# EAGLE design untitled (EAGLE 9.5.1)
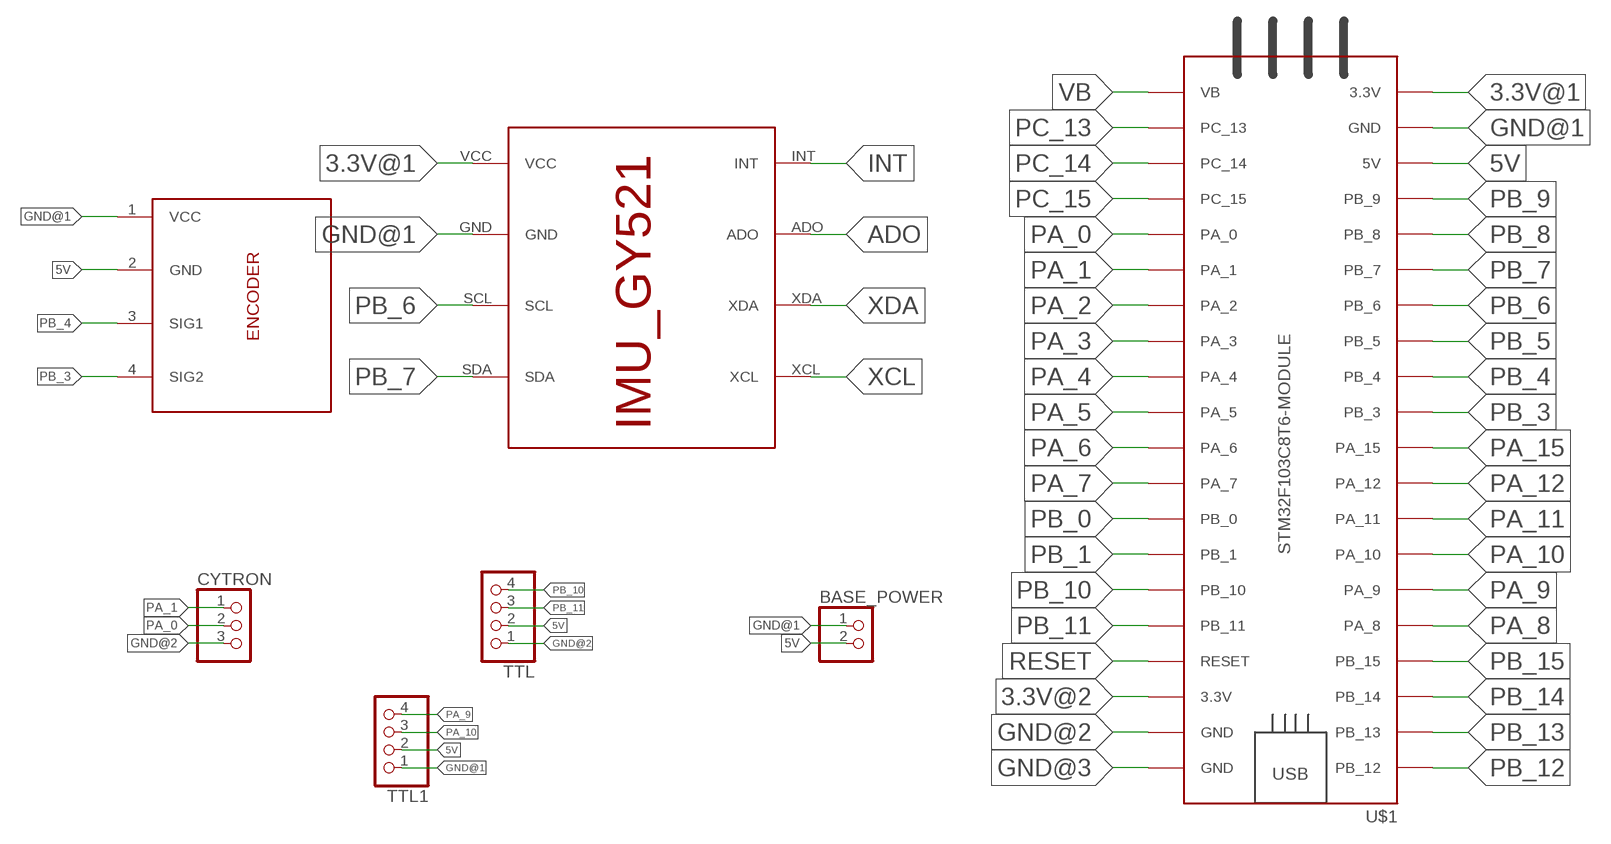
[diagram p0: schematic, sheet 1]

## Parts
BASE_POWER  PINHD-2_DATA  [1X02_DATA]
CYTRON  PINHD-3_DATA  [1X03_DATA]
TTL  PINHD-4_DATA  [1X04_DATA]
TTL1  PINHD-4_DATA  [1X04_DATA]
U$1  STM32F103C8T6-MODULE  [STM32F103C8T6-MODULE]
U$2  IMU_ROBOCON_GY521  [IMU_GY521]
U$3  ENCODER  [1X04_DATA]

## Nets
3.3V@1: U$1.3.3V_1(3.3V) U$2.VCC
3.3V@2: U$1.3.3V_2(3.3V)
5V: BASE_POWER.2 TTL1.2 TTL.2 U$1.5V U$3.2(GND)
ADO: U$2.ADO
GND@1: BASE_POWER.1 TTL1.1 U$1.GND_1(GND) U$2.GND U$3.1(VCC)
GND@2: CYTRON.3 TTL.1 U$1.GND_2(GND)
GND@3: U$1.GND_3(GND)
INT: U$2.INT
PA_0: CYTRON.2 U$1.PA_0
PA_1: CYTRON.1 U$1.PA_1
PA_2: U$1.PA_2
PA_3: U$1.PA_3
PA_4: U$1.PA_4
PA_5: U$1.PA_5
PA_6: U$1.PA_6
PA_7: U$1.PA_7
PA_8: U$1.PA_8
PA_9: TTL1.4 U$1.PA_9
PA_10: TTL1.3 U$1.PA_10
PA_11: U$1.PA_11
PA_12: U$1.PA_12
PA_15: U$1.PA_15
PB_0: U$1.PB_0
PB_1: U$1.PB_1
PB_3: U$1.PB_3 U$3.4(SIG2)
PB_4: U$1.PB_4 U$3.3(SIG1)
PB_5: U$1.PB_5
PB_6: U$1.PB_6 U$2.SCL
PB_7: U$1.PB_7 U$2.SDA
PB_8: U$1.PB_8
PB_9: U$1.PB_9
PB_10: TTL.4 U$1.PB_10
PB_11: TTL.3 U$1.PB_11
PB_12: U$1.PB_12
PB_13: U$1.PB_13
PB_14: U$1.PB_14
PB_15: U$1.PB_15
PC_13: U$1.PC_13
PC_14: U$1.PC_14
PC_15: U$1.PC_15
RESET: U$1.RESET
VB: U$1.VB
XCL: U$2.XCL
XDA: U$2.XDA

## Library data of the parts
BASE_POWER = MIA_LIBRARY-2-2-2:PINHD-2_DATA: PIN HEADER
CYTRON = MIA_LIBRARY-2-2-2:PINHD-3_DATA: PIN HEADER
TTL TTL1 = MIA_LIBRARY-2-2-2:PINHD-4_DATA: PIN HEADER
U$1 = MIA_LIBRARY-2-2-2:STM32F103C8T6-MODULE: STM32F103C8T6 module with ARM Cortex-3, 20kB SRAM, 64kB Flash, 72MHz
U$2 = MIA_LIBRARY-2-2-2:IMU_ROBOCON_GY521
U$3 = MIA_LIBRARY-2-2-2:ENCODER

## Board
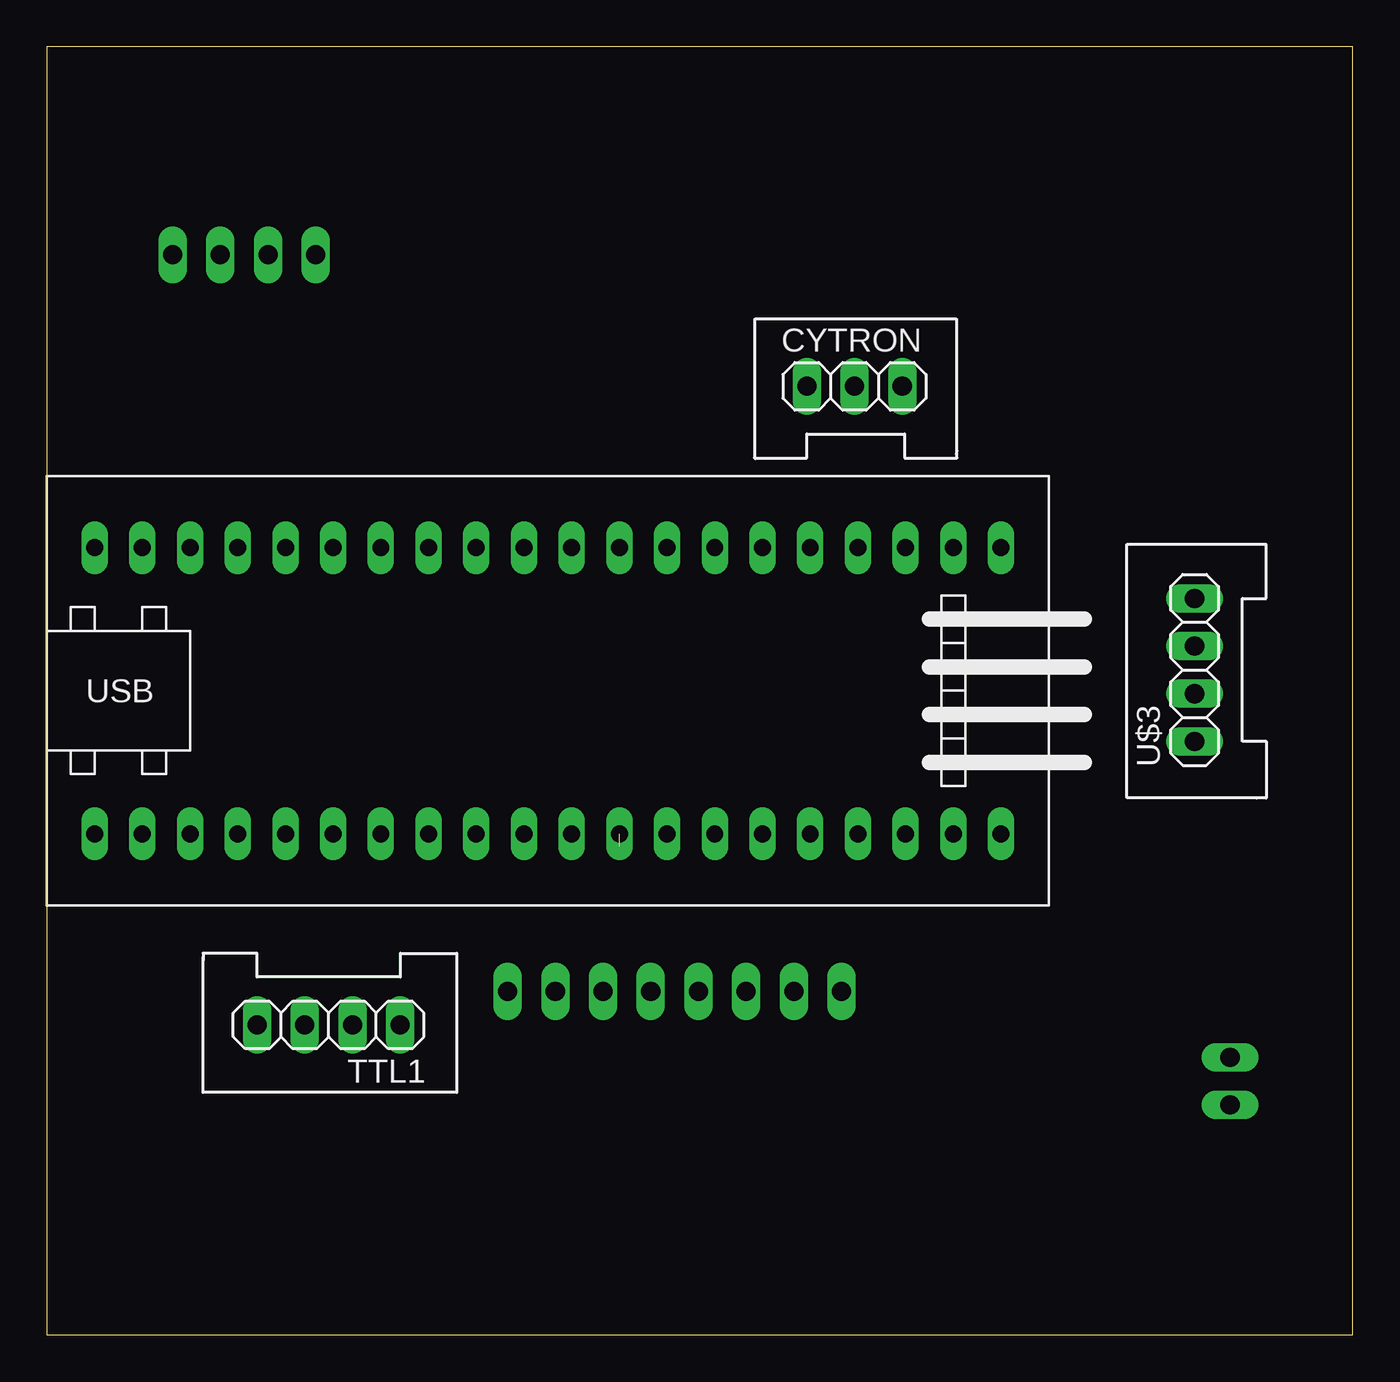
[diagram p1: board, top side]
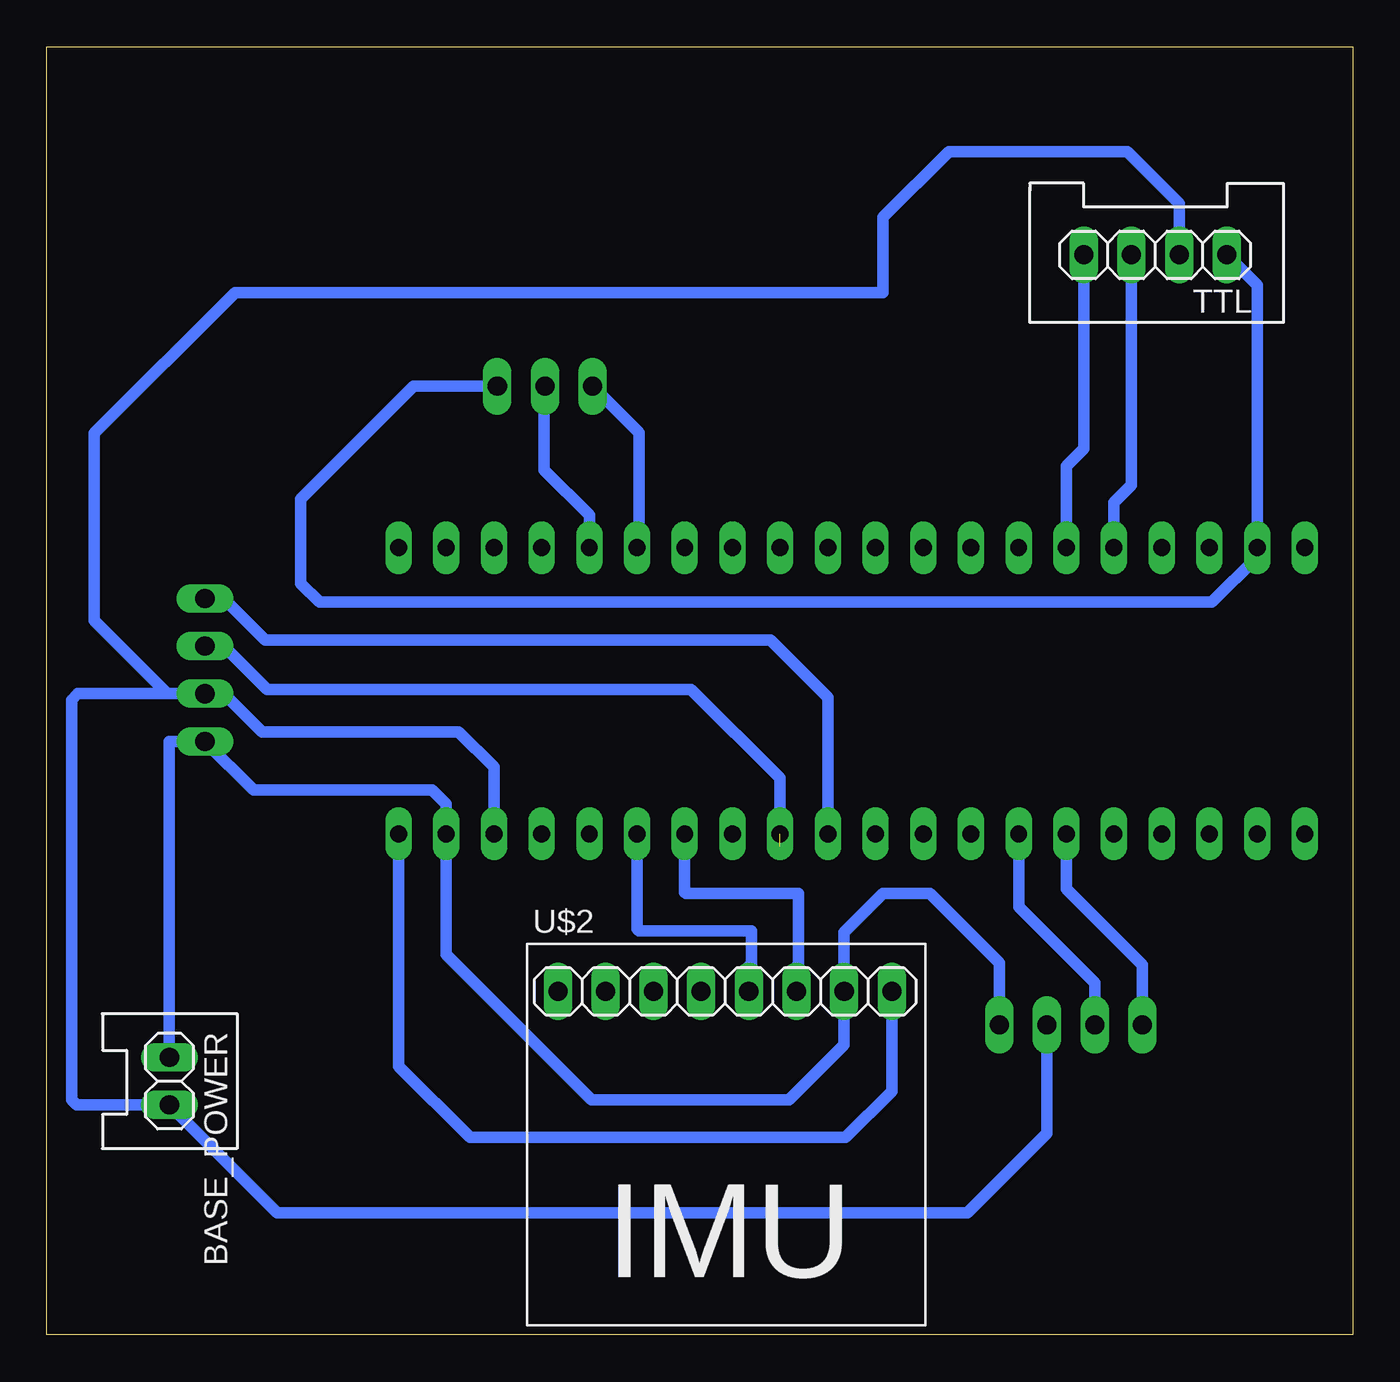
[diagram p2: board, bottom side, seen from below]

Size 69.52 x 68.57 mm. Coordinates in mm from the lower left corner, seen from the top.
Outline: 0,0 69.52,0 69.52,68.57 0,68.57 0,0
Copper layers (1*16): Top 0.035mm / dielectric 1.5mm / Bottom 0.035mm
Design rules "default": minimum track width 6mil, minimum drill 0.35mm, track to track 6mil, track to pad 6mil, pad to pad 6mil, via to via 6mil, smd to smd 6mil, copper to edge 40mil, drill to drill 6mil, minimum pad ring 10mil, minimum via ring 8mil, stop-mask expansion 4mil, vias tented up to drill 0mil, thermal gap 10mil

### Footprints (pad centres in the part's own frame; a part is rotated, then mirrored left to right if it is on the bottom)
1X02_DATA = drill 1.016 long: 1 -1.27,0; 2 1.27,0
1X03_DATA = drill 1.016 long: 1 -2.54,0; 2 0,0; 3 2.54,0
1X04_DATA = drill 1.016 long: 1 -3.81,0; 2 -1.27,0; 3 1.27,0; 4 3.81,0
STM32F103C8T6-MODULE = drill 0.9 long: 3.3V_1 25.4,-7.62; 3.3V_2 -17.78,7.62; 5V 20.32,-7.62; GND_1 22.86,-7.62; GND_2 -20.32,7.62; GND_3 -22.86,7.62; PA_0 15.24,7.62; PA_1 12.7,7.62; PA_2 10.16,7.62; PA_3 7.62,7.62; PA_4 5.08,7.62; PA_5 2.54,7.62; PA_6 0,7.62; PA_7 -2.54,7.62; PA_8 -12.7,-7.62; PA_9 -10.16,-7.62; PA_10 -7.62,-7.62; PA_11 -5.08,-7.62; PA_12 -2.54,-7.62; PA_15 0,-7.62; PB_0 -5.08,7.62; PB_1 -7.62,7.62; PB_3 2.54,-7.62; PB_4 5.08,-7.62; PB_5 7.62,-7.62; PB_6 10.16,-7.62; PB_7 12.7,-7.62; PB_8 15.24,-7.62; PB_9 17.78,-7.62; PB_10 -10.16,7.62; PB_11 -12.7,7.62; PB_12 -22.86,-7.62; PB_13 -20.32,-7.62; PB_14 -17.78,-7.62; PB_15 -15.24,-7.62; PC_13 22.86,7.62; PC_14 20.32,7.62; PC_15 17.78,7.62; RESET -15.24,7.62; VB 25.4,7.62
IMU_GY521 = drill 1.016 long: ADO -6.35,0; GND 6.35,0; INT -8.89,0; SCL 3.81,0; SDA 1.27,0; VCC 8.89,0; XCL -3.81,0; XDA -1.27,0

### Placement (x,y rotation side)
BASE_POWER  63,13.5 270 bottom
CYTRON  43,50.5 0 top
TTL  10.5,57.5 180 bottom
TTL1  15,16.5 180 top
U$1  25.4,34.29 0 top
U$2  33.42,18.28 0 bottom
U$3  61.11,35.4 90 top

### Tracks (layer width: path | path; a pad name or v marks a point on that pad's centre or on a via)
3.3V@1
  Bottom 0.61: U$2.VCC 24.53,12.97 27,10.5 47,10.5 50.8,14.3 U$1.3.3V_1
5V
  Bottom 0.61: 45.72,26.78 U$1.5V 45.72,30.22 47.59,32.09 58.07,32.09 60.11,34.13 U$3.2 | TTL.2 9.23,60.23 12,63 21.5,63 25,59.5 25,55.5 59.5,55.5 67,48 67,38.02 63.11,34.13 U$3.2 | TTL1.2 16.27,10.73 20.5,6.5 57.27,6.5 BASE_POWER.2 67.93,12.23 68.2,12.5 68.2,33.8 67.87,34.13 U$3.2
GND@1
  Bottom 0.61: U$2.GND 27.12,18.28 | 18.81,17.81 TTL1.1 18.81,19.81 22.5,23.5 25,23.5 27.07,21.43 U$2.GND | BASE_POWER.1 63,31.59 U$3.1 58.52,29 49,29 48.26,28.26 U$1.GND_1 48.26,20.24 40.52,12.5 30,12.5 27.07,15.43 U$2.GND
GND@2
  Bottom 0.61: TTL.1 5.08,55.89 U$1.GND_2 5.08,41.42 7.5,39 55,39 56,40 56,44.5 50,50.5 CYTRON.3
PA_0
  Bottom 0.61: U$1.PA_0 40.64,43.64 43.04,46.04 43.04,50.46 CYTRON.2
PA_1
  Bottom 0.61: U$1.PA_1 38,42.01 38,48.04 CYTRON.1
PA_9
  Bottom 0.61: U$1.PA_9 15.24,23.74 11.19,19.69 TTL1.4
PA_10
  Bottom 0.61: TTL1.3 13.73,18.73 17.78,22.78 U$1.PA_10
PB_3
  Bottom 0.61: U$3.4 60.11,39.21 57.9,37 31,37 27.94,33.94 U$1.PB_3
PB_4  (1 unrouted)
  Bottom 0.61: U$3.3 60.11,36.67 57.79,34.35 35.21,34.35 30.5,29.64 30.5,26
PB_6
  Bottom 0.61: 29.61,19.61 U$2.SCL 29.5,18.39 29.5,23.5 35.5,23.5 35.56,23.56 U$1.PB_6
PB_7
  Bottom 0.61: 32.15,19.65 U$2.SDA 32,18.43 32,21.5 38,21.5 38.1,21.6 U$1.PB_7
PB_10
  Bottom 0.61: TTL.4 14.31,47.19 15.24,46.26 U$1.PB_10
PB_11
  Bottom 0.61: TTL.3 11.77,45.23 12.7,44.3 U$1.PB_11